# EAGLE schematic project (EAGLE 9.1.0)
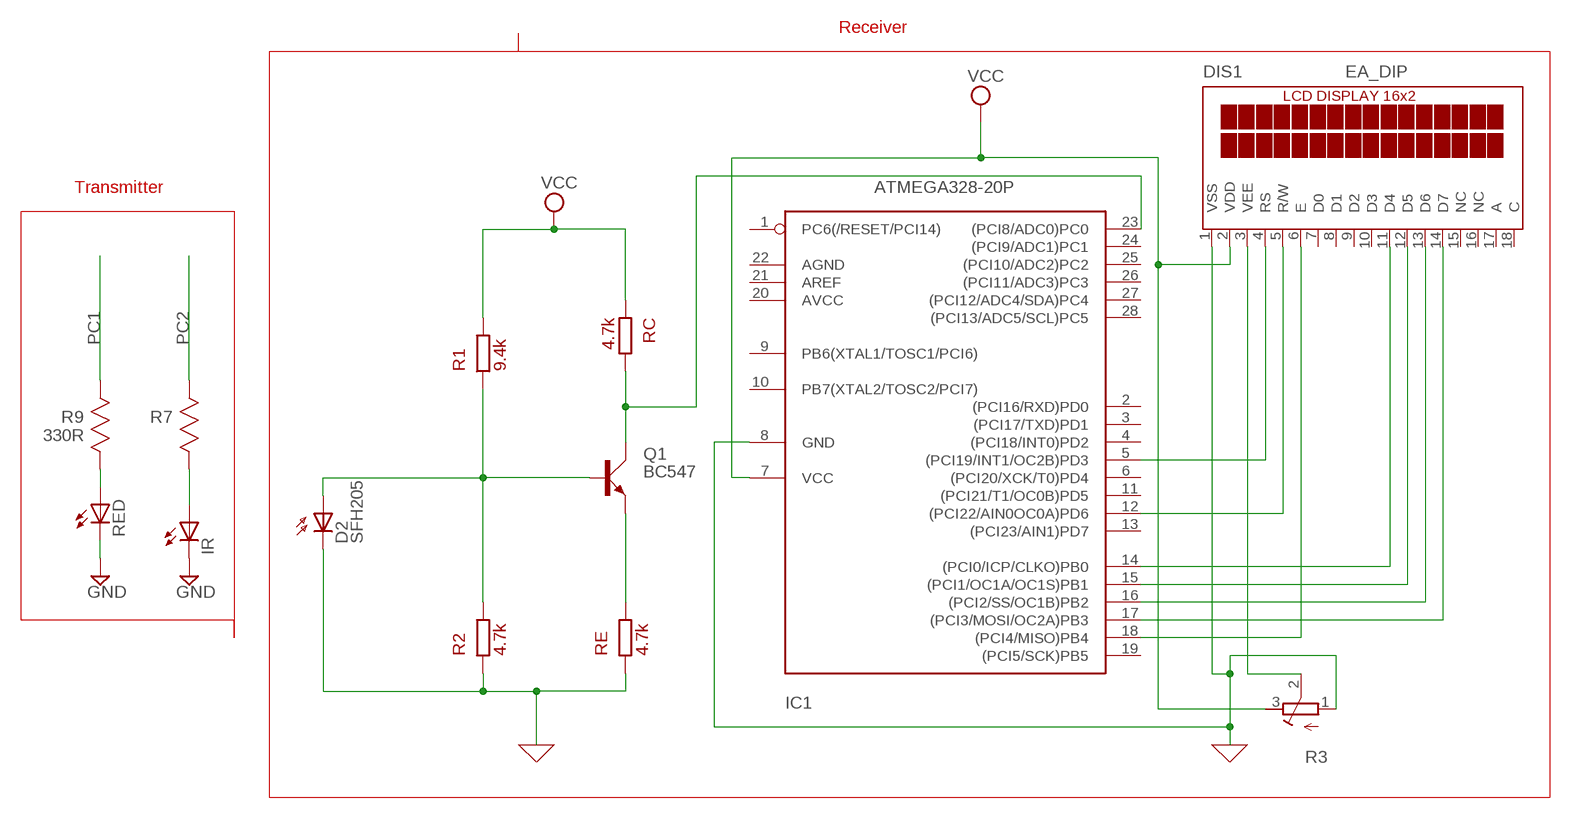
[diagram p0: schematic, sheet 1]

## Parts
D2  SFH205  [SFH205]
DIS1  EA_DIP  [EA_DIP]
IC1  ATMEGA328-20P  [DIL28-3]
IR  LEDCHIP-LED0603  [CHIP-LED0603]
Q1  BC547  [SOT54A]
R1  9.4k  R  (no package)
R2  4.7k  R  (no package)
R3  R-TRIMM4G/J  [RTRIM4G/J]
R7  330R  MC0.063W06031%330R  [RESC1608X60N]
R9  330R  MC0.063W06031%330R  [RESC1608X60N]
RC  4.7k  R  (no package)
RE  4.7k  R  (no package)
RED  LEDCHIP-LED0603  [CHIP-LED0603]

## Nets
0: D2.K(C) DIS1.1(VSS) IC1.8(GND) R2.1 R3.1(A) RE.1 ; supply symbol labelled GND
GND: IR.C RED.C
N$1: IR.A R7.2(R2)
N$2: IC1.23((PCI8/ADC0)PC0) Q1.C RC.2
N$3: R9.2(R2) RED.A
N$4: Q1.E RE.2
N$5: D2.A Q1.B R1.1 R2.2
N$6: DIS1.4(RS) IC1.5((PCI19/INT1/OC2B)PD3)
N$7: DIS1.5(R/W) IC1.12((PCI22/AIN0OC0A)PD6)
N$8: DIS1.6(E) IC1.18((PCI4/MISO)PB4)
N$9: DIS1.11(D4) IC1.14((PCI0/ICP/CLKO)PB0)
N$10: DIS1.12(D5) IC1.15((PCI1/OC1A/OC1S)PB1)
N$11: DIS1.13(D6) IC1.16((PCI2/SS/OC1B)PB2)
N$12: DIS1.14(D7) IC1.17((PCI3/MOSI/OC2A)PB3)
N$13: DIS1.3(VEE) R3.2(S)
PC1: R9.1(R1)
PC2: R7.1(R1)
VCC: DIS1.2(VDD) IC1.7(VCC) R1.2 R3.3(E) RC.1
Unconnected: DIS1.7(D0) DIS1.8(D1) DIS1.9(D2) DIS1.10(D3) DIS1.15(NC) DIS1.16(NC) DIS1.17(A) DIS1.18(C) IC1.1(PC6(/RESET/PCI14)) IC1.2((PCI16/RXD)PD0) IC1.3((PCI17/TXD)PD1) IC1.4((PCI18/INT0)PD2) IC1.6((PCI20/XCK/T0)PD4) IC1.9(PB6(XTAL1/TOSC1/PCI6)) IC1.10(PB7(XTAL2/TOSC2/PCI7)) IC1.11((PCI21/T1/OC0B)PD5) IC1.13((PCI23/AIN1)PD7) IC1.19((PCI5/SCK)PB5) IC1.20(AVCC) IC1.21(AREF) IC1.22(AGND) IC1.24((PCI9/ADC1)PC1) IC1.25((PCI10/ADC2)PC2) IC1.26((PCI11/ADC3)PC3) IC1.27((PCI12/ADC4/SDA)PC4) IC1.28((PCI13/ADC5/SCL)PC5)

## Notes on the sheet
- Receiver
- Transmitter

## Library data of the parts
D2 = opto-trans-siemens:SFH205: PHOTO DIODE; OC_FARNELL: unknown; OC_NEWARK: unknown
DIS1 = display-lcd:EA_DIP: LCD-MODUL 2x16 - 6,68mm, INKL. KONTROLLER HD44780 Source: Data sheet <http://www.lcd-module.de/pdf/doma/dip162-d.pdf>
IC1 = atmega328:ATMEGA328*P: MICROCONTROLLER 32 kBytes FLASH 2 kBytes SRAM 1 kBytes EEPROM USART 8-channel 10 bit ADC
IR RED = led:LED: LED OSRAM: - CHIPLED LG R971, LG N971, LY N971, LG Q971, LY Q971, LO R971, LY R971 LH N974, LH R974 LS Q976, LO Q976, LY Q976 LO Q996 - Hyper CHIPLED LW Q18S LB Q993, LB Q99A, LB R99A - SideLED LS A670, LO A670, LY A670, LG A670, LP A670 LB A673, LV A673, LT A673, LW A673 LH A674 LY A675 LS A676, LA A676, LO A676, LY A676, LW A676 LS A679, LY A679, LG A679 - Hyper Micro SIDELED® LS Y876, LA Y876, LO Y876, LY Y876 LT Y87S - SmartLED LW L88C, LW L88S LB L89C, LB L89S, LG L890 LS L89K, LO L89K, LY L89K LS L896, LA L896, LO L896, LY L896 - TOPLED LS T670, LO T670, LY T670, LG T670, LP T670 LSG T670, LSP T670, LSY T670, LOP T670, LYG T670 LG T671, LOG T671, LSG T671 LB T673, LV T673, LT T673, LW T673 LH T674 LS T676, LA T676, LO T676, LY T676, LB T676, LH T676, LSB T676, LW T676 LB T67C, LV T67C, LT T67C, LS T67K, LO T67K, LY T67K, LW E67C LS E67B, LA E67B, LO E67B, LY E67B, LB E67C, LV E67C, LT E67C LW T67C LS T679, LY T679, LG T679 LS T770, LO T770, LY T770, LG T770, LP T770 LB T773, LV T773, LT T773, LW T773 LH T774 LS E675, LA E675, LY E675, LS T675 LS T776, LA T776, LO T776, LY T776, LB T776 LHGB T686 LT T68C, LB T68C - Hyper Mini TOPLED® LB M676 - Mini TOPLED Santana® LG M470 LS M47K, LO M47K, LY M47K Source: http://www.osram.convergy.de LUXEON: - LUMILED® LXK2-PW12-R00, LXK2-PW12-S00, LXK2-PW14-U00, LXK2-PW14-V00 LXK2-PM12-R00, LXK2-PM12-S00, LXK2-PM14-U00 LXK2-PE12-Q00, LXK2-PE12-R00, LXK2-PE12-S00, LXK2-PE14-T00, LXK2-PE14-U00 LXK2-PB12-K00, LXK2-PB12-L00, LXK2-PB12-M00, LXK2-PB14-N00, LXK2-PB14-P00, LXK2-PB14-Q00 LXK2-PR12-L00, LXK2-PR12-M00, LXK2-PR14-Q00, LXK2-PR14-R00 LXK2-PD12-Q00, LXK2-PD12-R00, LXK2-PD12-S00 LXK2-PH12-R00, LXK2-PH12-S00 LXK2-PL12-P00, LXK2-PL12-Q00, LXK2-PL12-R00 Source: www.luxeon.com KINGBRIGHT: KA-3528ASYC Source: www.kingbright.com
Q1 = transistor-small-signal:BC547: NPN TRANSISTOR
R1 R2 RC RE = ngspice-simulation:R: RESISTOR
R3 = resistor:R-TRIMM: Trimm resistor
R7 R9 = Multicomp:MC0.063W06031%330R: RESISTOR, 0603; MPN: MC0.063W06031%330R; OC_FARNELL: 9331018; OC_NEWARK: -; SUPPLIER: Multicomp; TOLERANCE: ±1%; VALUE: 330 Ohms; WATTAGE: 1/16 W